# Altium schematic sheet MCU.SchDoc
size A; SheetNumber: 3; SheetTotal: 8
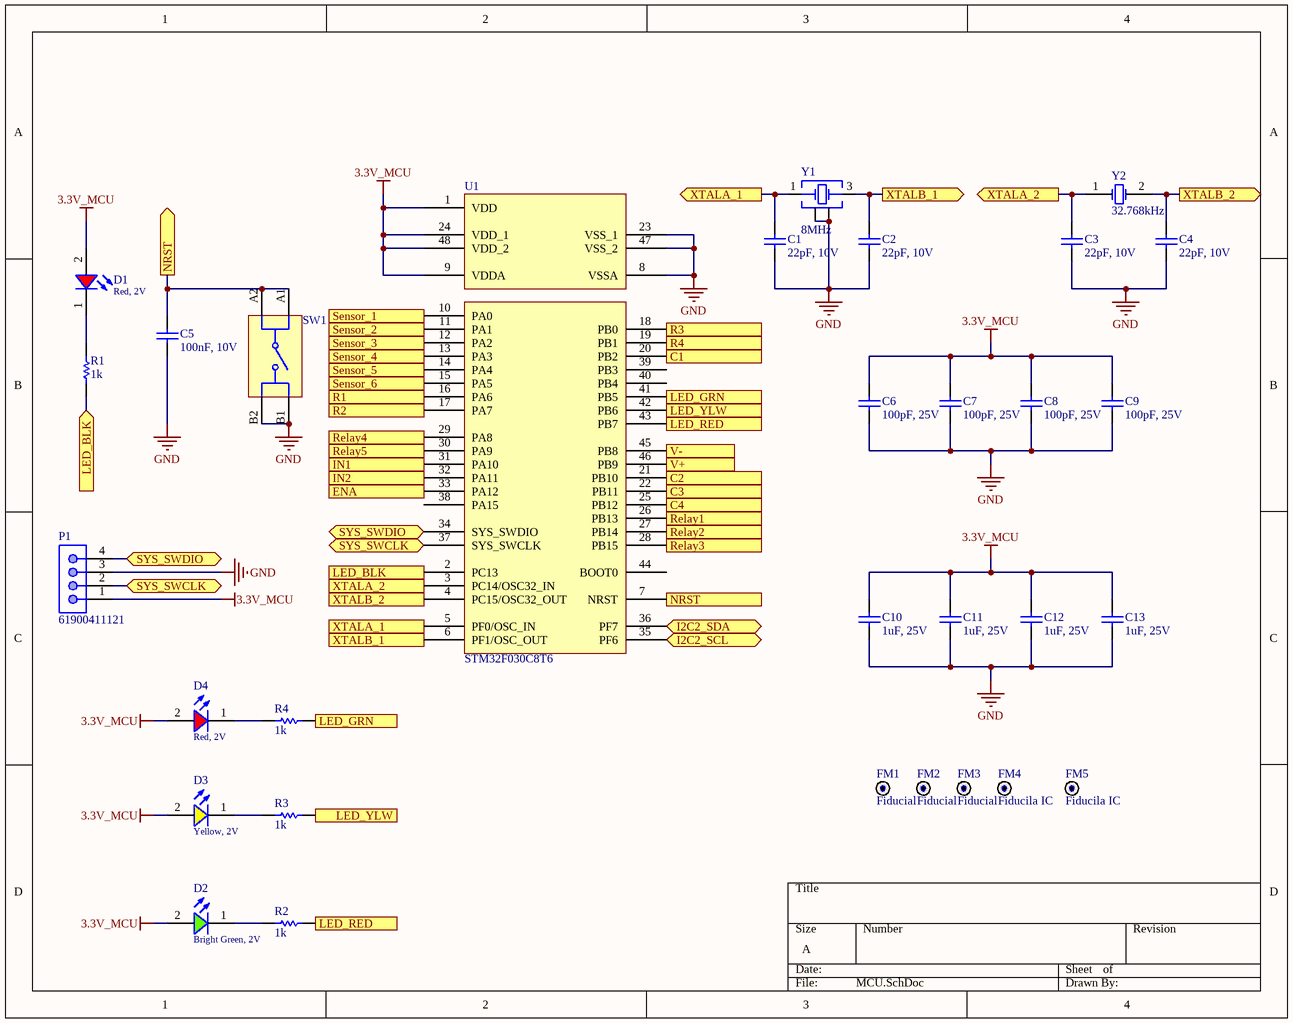
[diagram p0: MCU.SchDoc]

## Parts
C1  22pF, 10V  [WCAP-CSGP_0603_H=0.8mm_Reflow]
C2  22pF, 10V  [WCAP-CSGP_0603_H=0.8mm_Reflow]
C3  22pF, 10V  [WCAP-CSGP_0603_H=0.8mm_Reflow]
C4  22pF, 10V  [WCAP-CSGP_0603_H=0.8mm_Reflow]
C5  100nF, 10V  [WCAP-CSGP_0603_H=0.8mm_Reflow]
C6  100pF, 25V  [WCAP-CSGP_0603_H=0.8mm_Reflow]
C7  100pF, 25V  [WCAP-CSGP_0603_H=0.8mm_Reflow]
C8  100pF, 25V  [WCAP-CSGP_0603_H=0.8mm_Reflow]
C9  100pF, 25V  [WCAP-CSGP_0603_H=0.8mm_Reflow]
C10  1uF, 25V  [WCAP-CSGP_0603_H=0.8mm_Reflow]
C11  1uF, 25V  [WCAP-CSGP_0603_H=0.8mm_Reflow]
C12  1uF, 25V  [WCAP-CSGP_0603_H=0.8mm_Reflow]
C13  1uF, 25V  [WCAP-CSGP_0603_H=0.8mm_Reflow]
D1  Red, 2V  [WL-SMCW_0603_H=0.7mm]
D2  Bright Green, 2V  [WL-SMCW_0603_H=0.7mm]
D3  Yellow, 2V  [WL-SMCW_0603_H=0.7mm]
D4  Red, 2V  [WL-SMCW_0603_H=0.7mm]
FM1  Fiducial  [FUDICIAL_MARKER]  (no BOM)
FM2  Fiducial  [FUDICIAL_MARKER]  (no BOM)
FM3  Fiducial  [FUDICIAL_MARKER]  (no BOM)
FM4  Fiducila IC  [Fiducial Mark IC]  (no BOM)
FM5  Fiducila IC  [Fiducial Mark IC]  (no BOM)
P1  61900411121  [61900411121]
R1  value 1k  [RES-SM-0603]  (hidden comment: ESR03EZPJ102)
R2  value 1k  [RES-SM-0603]  (hidden comment: ESR03EZPJ102)
R3  value 1k  [RES-SM-0603]  (hidden comment: ESR03EZPJ102)
R4  value 1k  [RES-SM-0603]  (hidden comment: ESR03EZPJ102)
SW1  430152050826  [WS-TASV_L6W6H5_4301x20508x6]  (value not drawn)
U1  STM32F030C8T6  [STM32F030C8T6]
Y1  8MHz  [WE-XTAL_CFPX-180]
Y2  32.768kHz  [WE-XTAL_IQXC-90]

## Ports
C1 (in), C2 (in), C3 (in), C4 (in), ENA (out), I2C2_SCL (bidir), I2C2_SDA (bidir), IN1 (out), IN2 (out), LED_BLK (in), LED_BLK (out), LED_GRN (in), LED_GRN (out), LED_RED (in), LED_RED (out), LED_YLW (in), LED_YLW (out), NRST (in), NRST (out), R1 (in), R2 (in), R3 (in), R4 (in), Relay1 (out), Relay2 (out), Relay3 (out), Relay4 (out), Relay5 (out), Sensor_1 (in), Sensor_2 (in), Sensor_3 (in), Sensor_4 (in), Sensor_5 (in), Sensor_6 (in), SYS_SWCLK (bidir), SYS_SWDIO (bidir), V+ (out), V- (out), XTALA_1 (in), XTALA_1 (out), XTALA_2 (in), XTALA_2 (out), XTALB_1 (in), XTALB_1 (out), XTALB_2 (in), XTALB_2 (out)

## Nets
3.3V_MCU: C6.2 C7.2 C8.2 C9.2 C10.2 C11.2 C12.2 C13.2 D1.2(A) D2.2(A) D3.2(A) D4.2(A) P1.1 U1.1(VDD) U1.9(VDDA) U1.24(VDD_1) U1.48(VDD_2)
GND: C1.2 C2.2 C3.2 C4.2 C5.1 C6.1 C7.1 C8.1 C9.1 C10.1 C11.1 C12.1 C13.1 P1.3 SW1.B1 SW1.B2 U1.8(VSSA) U1.23(VSS_1) U1.47(VSS_2) Y1.2(GND&Lid) Y1.4(GND&Lid)
C1: U1.20(PB2) ; port C1
C2: U1.21(PB10) ; port C2
C3: U1.22(PB11) ; port C3
C4: U1.25(PB12) ; port C4
ENA: U1.33(PA12) ; port ENA
I2C2_SCL: U1.35(PF6) ; port I2C2_SCL
I2C2_SDA: U1.36(PF7) ; port I2C2_SDA
IN1: U1.31(PA10) ; port IN1
IN2: U1.32(PA11) ; port IN2
LED_BLK: R1.1 U1.2(PC13) ; port LED_BLK
LED_GRN: R4.1 U1.41(PB5) ; port LED_GRN
LED_RED: R2.1 U1.43(PB7) ; port LED_RED
LED_YLW: R3.1 U1.42(PB6) ; port LED_YLW
NRST: C5.2 SW1.A1 SW1.A2 U1.7(NRST) ; port NRST
R1: U1.16(PA6) ; port R1
R2: U1.17(PA7) ; port R2
R3: U1.18(PB0) ; port R3
R4: U1.19(PB1) ; port R4
Relay1: U1.26(PB13) ; port Relay1
Relay2: U1.27(PB14) ; port Relay2
Relay3: U1.28(PB15) ; port Relay3
Relay4: U1.29(PA8) ; port Relay4
Relay5: U1.30(PA9) ; port Relay5
Sensor_1: U1.10(PA0) ; port Sensor_1
Sensor_2: U1.11(PA1) ; port Sensor_2
Sensor_3: U1.12(PA2) ; port Sensor_3
Sensor_4: U1.13(PA3) ; port Sensor_4
Sensor_5: U1.14(PA4) ; port Sensor_5
Sensor_6: U1.15(PA5) ; port Sensor_6
SYS_SWCLK: P1.2 U1.37(SYS_SWCLK) ; port SYS_SWCLK
SYS_SWDIO: P1.4 U1.34(SYS_SWDIO) ; port SYS_SWDIO
V+: U1.46(PB9) ; port V+
V-: U1.45(PB8) ; port V-
XTALA_1: C1.1 U1.5(PF0/OSC_IN) Y1.1(Crystal) ; port XTALA_1
XTALA_2: C3.1 U1.3(PC14/OSC32_IN) Y2.1(OSC1) ; port XTALA_2
XTALB_1: C2.1 U1.6(PF1/OSC_OUT) Y1.3(Crystal) ; port XTALB_1
XTALB_2: C4.1 U1.4(PC15/OSC32_OUT) Y2.2(OSC2) ; port XTALB_2
NetD1_1: D1.1(K) R1.2
NetD2_1: D2.1(K) R2.2
NetD3_1: D3.1(K) R3.2
NetD4_1: D4.1(K) R4.2

Not connected (* = marked no-connect by the designer): U1 38(PA15) 39(PB3) 40(PB4) 44(BOOT0)

## Library data of the parts
C1-C4 = 885012006004: WCAP-CSGP Multilayer Ceramic Chip Capacitor, General Purpose, size 0603, NP0, 22pF, 10V; Manufacturer: Wurth Elektronik; Rated Voltage: 10VDC; Isolation Resistance: >=10GOhm; Capacitance Tolerance: +/-5%; Dissipation Factor: Q>=400+20C; Technical Reference: NP00603220J010DFCT10000; No. Pad (SMD): 2; No. Pad (THT): 0; ComponentLink1Description: Manufacturer; ComponentLink1URL: http://www.we-online.de; ComponentLink2Description: Datasheet; ComponentLink2URL: https://www.we-online.com/catalog/datasheet/885012006004.pdf; Operating Temperature: -55 to +125degC; Packaging: Tape and Reel; Manufacturer Part Number: 885012006004; Published Date: May 2020; Ceramic Type: NP0; Height: 0.8mm; Mounting Technology: SMT; Size: 0603; Capacitance: 22pF; Unit Price (Digikey): 0.1
C5 = 885012206020: WCAP-CSGP Multilayer Ceramic Chip Capacitor, General Purpose, size 0603, X7R, 100nF, 10V; Manufacturer: Wurth Elektronik; Rated Voltage: 10VDC; Isolation Resistance: >=5GOhm; Capacitance Tolerance: +/-10%; Technical Reference: X7R0603104K010DFCT10000; No. Pad (SMD): 2; No. Pad (THT): 0; ComponentLink1Description: Manufacturer; ComponentLink1URL: http://www.we-online.de; ComponentLink2Description: Datasheet; ComponentLink2URL: https://www.we-online.com/catalog/datasheet/885012206020.pdf; Operating Temperature: -55 to +125degC; Packaging: Tape and Reel; Manufacturer Part Number: 885012206020; Published Date: May 2020; Ceramic Type: X7R; Dissipation Factor: =<5%; Height: 0.8mm; Mounting Technology: SMT; Size: 0603; Capacitance: 100nF; Unit Price (Digikey): 0.1
C6-C9 = 885012006038: WCAP-CSGP Multilayer Ceramic Chip Capacitor, General Purpose, size 0603, NP0, 100pF, 25V; Manufacturer: Wurth Elektronik; Rated Voltage: 25VDC; Isolation Resistance: >=10GOhm; Capacitance Tolerance: +/-5%; Dissipation Factor: Q>=1000; Technical Reference: NP00603101J025DFCT10000; No. Pad (SMD): 2; No. Pad (THT): 0; ComponentLink1Description: Manufacturer; ComponentLink1URL: http://www.we-online.de; ComponentLink2Description: Datasheet; ComponentLink2URL: https://www.we-online.com/catalog/datasheet/885012006038.pdf; Operating Temperature: -55 to +125degC; Packaging: Tape and Reel; Manufacturer Part Number: 885012006038; Published Date: May 2020; Ceramic Type: NP0; Height: 0.8mm; Mounting Technology: SMT; Size: 0603; Capacitance: 100pF; Unit Price (Digikey): 0.1
C10-C13 = 885012106022: WCAP-CSGP Multilayer Ceramic Chip Capacitor, General Purpose, size 0603, X5R, 1uF, 25V; Manufacturer: Wurth Elektronik; Rated Voltage: 25VDC; Isolation Resistance: >=0.5GOhm; Capacitance Tolerance: +/-20%; Technical Reference: X5R0603105M025DFCT10000; No. Pad (SMD): 2; No. Pad (THT): 0; ComponentLink1Description: Manufacturer; ComponentLink1URL: http://www.we-online.de; ComponentLink2Description: Datasheet; ComponentLink2URL: https://www.we-online.com/catalog/datasheet/885012106022.pdf; Operating Temperature: -55 to +85degC; Packaging: Tape and Reel; Manufacturer Part Number: 885012106022; Published Date: May 2020; Ceramic Type: X5R; Dissipation Factor: =<10%; Height: 0.8mm; Mounting Technology: SMT; Size: 0603; Capacitance: 1uF; Unit Price (Digikey): 0.43
D1 D4 = 150060RS75000: WL-SMCW SMT Mono-color Chip LED Waterclear, size 0603, Red, 2V, 140deg; Chip Technology: AlInGaP; Dominant Wavelength typ.: 625nm; Luminous Intensity typ.: 250mcd; Peak Wavelength typ.: 630nm; No. Pad (SMD): 2; No. Pad (THT): 0; Viewing Angle: 140deg; ComponentLink1Description: Manufacturer; ComponentLink1URL: http://www.we-online.de; ComponentLink2URL: https://www.we-online.com/catalog/datasheet/150060RS75000.pdf; ComponentLink2Description: Datasheet; Forward Voltage typ.: 2V; Emitting Color: Red; Mounting Technology: SMT; Operating Temperature: -40 to +85degC; Published Date: December 2019; Part Number: 150060RS75000; Packaging: Tape and Reel; Size: 0603; Publisher: Wurth Elektronik; Unit Price (Digikey): 0.15
  D4: Parameter 2: *; Parameter 3: *
D2 = 150060VS75000: WL-SMCW SMT Mono-color Chip LED Waterclear, size 0603, Bright Green, 2V, 140deg; Chip Technology: AlInGaP; Dominant Wavelength typ.: 570nm; Luminous Intensity typ.: 40mcd; Peak Wavelength typ.: 572nm; No. Pad (SMD): 2; No. Pad (THT): 0; Viewing Angle: 140deg; ComponentLink1Description: Manufacturer; ComponentLink1URL: http://www.we-online.de; ComponentLink2URL: https://www.we-online.com/catalog/datasheet/150060VS75000.pdf; ComponentLink2Description: Datasheet; Forward Voltage typ.: 2V; Emitting Color: Bright Green; Mounting Technology: SMT; Operating Temperature: -40 to +85degC; Published Date: December 2019; Part Number: 150060VS75000; Packaging: Tape and Reel; Size: 0603; Publisher: Wurth Elektronik; Unit Price (Digikey): 0.15
D3 = 150060YS75000: WL-SMCW SMT Mono-color Chip LED Waterclear, size 0603, Yellow, 2V, 140deg; Chip Technology: AlInGaP; Dominant Wavelength typ.: 590nm; Luminous Intensity typ.: 120mcd; Peak Wavelength typ.: 595nm; No. Pad (SMD): 2; No. Pad (THT): 0; Viewing Angle: 140deg; ComponentLink1Description: Manufacturer; ComponentLink1URL: http://www.we-online.de; ComponentLink2URL: https://www.we-online.com/catalog/datasheet/150060YS75000.pdf; ComponentLink2Description: Datasheet; Forward Voltage typ.: 2V; Emitting Color: Yellow; Mounting Technology: SMT; Operating Temperature: -40 to +85degC; Published Date: December 2019; Part Number: 150060YS75000; Packaging: Tape and Reel; Size: 0603; Publisher: Wurth Elektronik; Unit Price (Digikey): 0.15
P1 = 61900411121: WR-WTB THT Male Vertical Locking Header, pitch 2.54mm, 4p; Pin Number: 4; Contact Resistance: 20mOhm; Rated Current: 3A; Withstanding Voltage: 1000VAC; Working Voltage: 250VAC; No. Pad (SMD): 0; ComponentLink1Description: Manufacturer; ComponentLink1URL: http://www.we-online.de; ComponentLink2Description: Datasheet; ComponentLink2URL: https://www.we-online.com/catalog/datasheet/61900411121.pdf; Pitch: 2.54mm; Published Date: January 2020; Publisher: Wurth Elektronik; Mounting Technology: THT; Packaging: Bag; Operating Temperature: -40 to +105degC; Part Number: 61900411121; Gender: Male; Type: Vertical; No. Pad (THT): 4; Unit Price (Digikey): 0.94
R1-R4 = RESISTOR SMD: RES SMD 1K OHM 5% 1/4W 0603; Mfr: Rohm Semiconductor; Resistance: 1 kOhms; Power (Watts): 0.25W, 1/4W; Temperature Coefficient: ±200ppm/°C; No. Pad (SMD): 2; No. Pad (THT): 0; Category: Resistors; Series: ESR; Tolerance: ±5%; Composition: Thick Film; Features: Automotive AEC-Q200, Pulse Withstanding; Operating Temperature: -55°C ~ 155°C; Package / Case: 0603 (1608 Metric); Supplier Device Package: 0603; Ratings: AEC-Q200; Size / Dimension: 0.063" L x 0.031" W (1.60mm x 0.80mm); Height - Seated (Max): 0.022" (0.55mm); Number of Terminations: 2; Unit Price (Digikey): 0.14
SW1 = 430152050826: WS-TASV SMT Tact Switch, 12VDC, 50mA, 260g, height 5mm; Manufacturer: Wurth Elektronik; Rated Voltage: 12V; Washable: No; Actuator Color: White; Electrical Life: 200000Cycles; No. Pad (SMD): 4; No. Pad (THT): 0; ComponentLink1Description: Manufacturer Link; ComponentLink1URL: http://www.we-online.de; ComponentLink2Description: Datasheet; ComponentLink2URL: https://www.we-online.com/catalog/datasheet/430152050826.pdf; Manufacturer Part Number: 430152050826; Contact Material: Stainless Steel; Mounting Technology: SMT; Contact Plating: Silver; Operation Force: 260g; Packaging: Tape and Reel; Terminal Material: Copper Alloy; Rated Current: 50mA; Terminal Plating: Silver; Height: 5mm; Length: 6mm; Operating Temperature max.: 85C; Operating Temperature min.: -40C; Width: 6mm; Unit Price (Digikey): 0.5
U1 = STM32F030C8T6: / ARM® Cortex®-M0 series Microcontroller IC 32-Bit Single-Core 48MHz 64KB (64K x 8) FLASH 48-LQFP (7x7); Mfr: STMicroelectronics; Connectivity: I²C, SPI, UART/USART; Peripherals: DMA, POR, PWM, WDT; Number of I/O: 39; RAM Size: 8K x 8; Voltage - Supply (Vcc/Vdd): 2.4V ~ 3.6V; Data Converters: A/D 12x12b; Oscillator Type: Internal; No. Pad (SMD): 48; No. Pad (THT): 0; Core Processor: ARM® Cortex®-M0; Core Size: 32-Bit Single-Core; Speed: 48MHz; Program Memory Size: 64KB (64K x 8); Program Memory Type: FLASH; Operating Temperature: -40°C ~ 85°C (TA); Mounting Type: Surface Mount; Supplier Device Package: 48-LQFP (7x7); ComponentLink1Description: Digikey; ComponentLink1URL: https://www.digikey.com/en/products/detail/stmicroelectronics/STM32F030C8T6/4357252; Unit Price (Digikey): 3.25
Y1 = 830108313809: WE-XTAL Quartz Crystal, SMT, CFPX-180, 8MHz, +/-30ppm; Manufacturer: Wurth Elektronik; Frequency Stability: +/-50ppm; Load Capacitance: 12pF; No. Pad (SMD): 4; No. Pad (THT): 0; ComponentLink1Description: Manufacturer; ComponentLink1URL: http://www.we-online.de; ComponentLink2Description: Datasheet; ComponentLink2URL: https://www.we-online.com/catalog/datasheet/830108313809.pdf; Operating Temperature: -40 to +85degC; Packaging: Tape and Reel; Manufacturer Part Number: 830108313809; Published Date: November 2020; Size: CFPX-180; Frequency: 8MHz; Frequency Tolerance: +/-30ppm; Mounting Technology: SMT; Unit Price (Digikey): 0.58
Y2 = 830065253: WE-XTAL Watch Crystal, SMT, IQXC-90, 32.768kHz, +/-20ppm; Manufacturer: Wurth Elektronik; Load Capacitance: 12.5pF; No. Pad (SMD): 2; No. Pad (THT): 0; ComponentLink1Description: Manufacturer; ComponentLink1URL: http://www.we-online.de; ComponentLink2Description: Datasheet; ComponentLink2URL: https://katalog.we-online.com/pbs/datasheet/830065253.pdf; Operating Temperature: -40 to +85degC; Packaging: Tape and Reel; Manufacturer Part Number: 830065253; Published Date: July 2020; Size: IQXC-90; Frequency Stability: -; Frequency: 32.768kHz; Frequency Tolerance: +/-20ppm; Mounting Technology: SMT; Unit Price (Digikey): 1.75